# EAGLE design optoSensor (EAGLE 9.6.2)
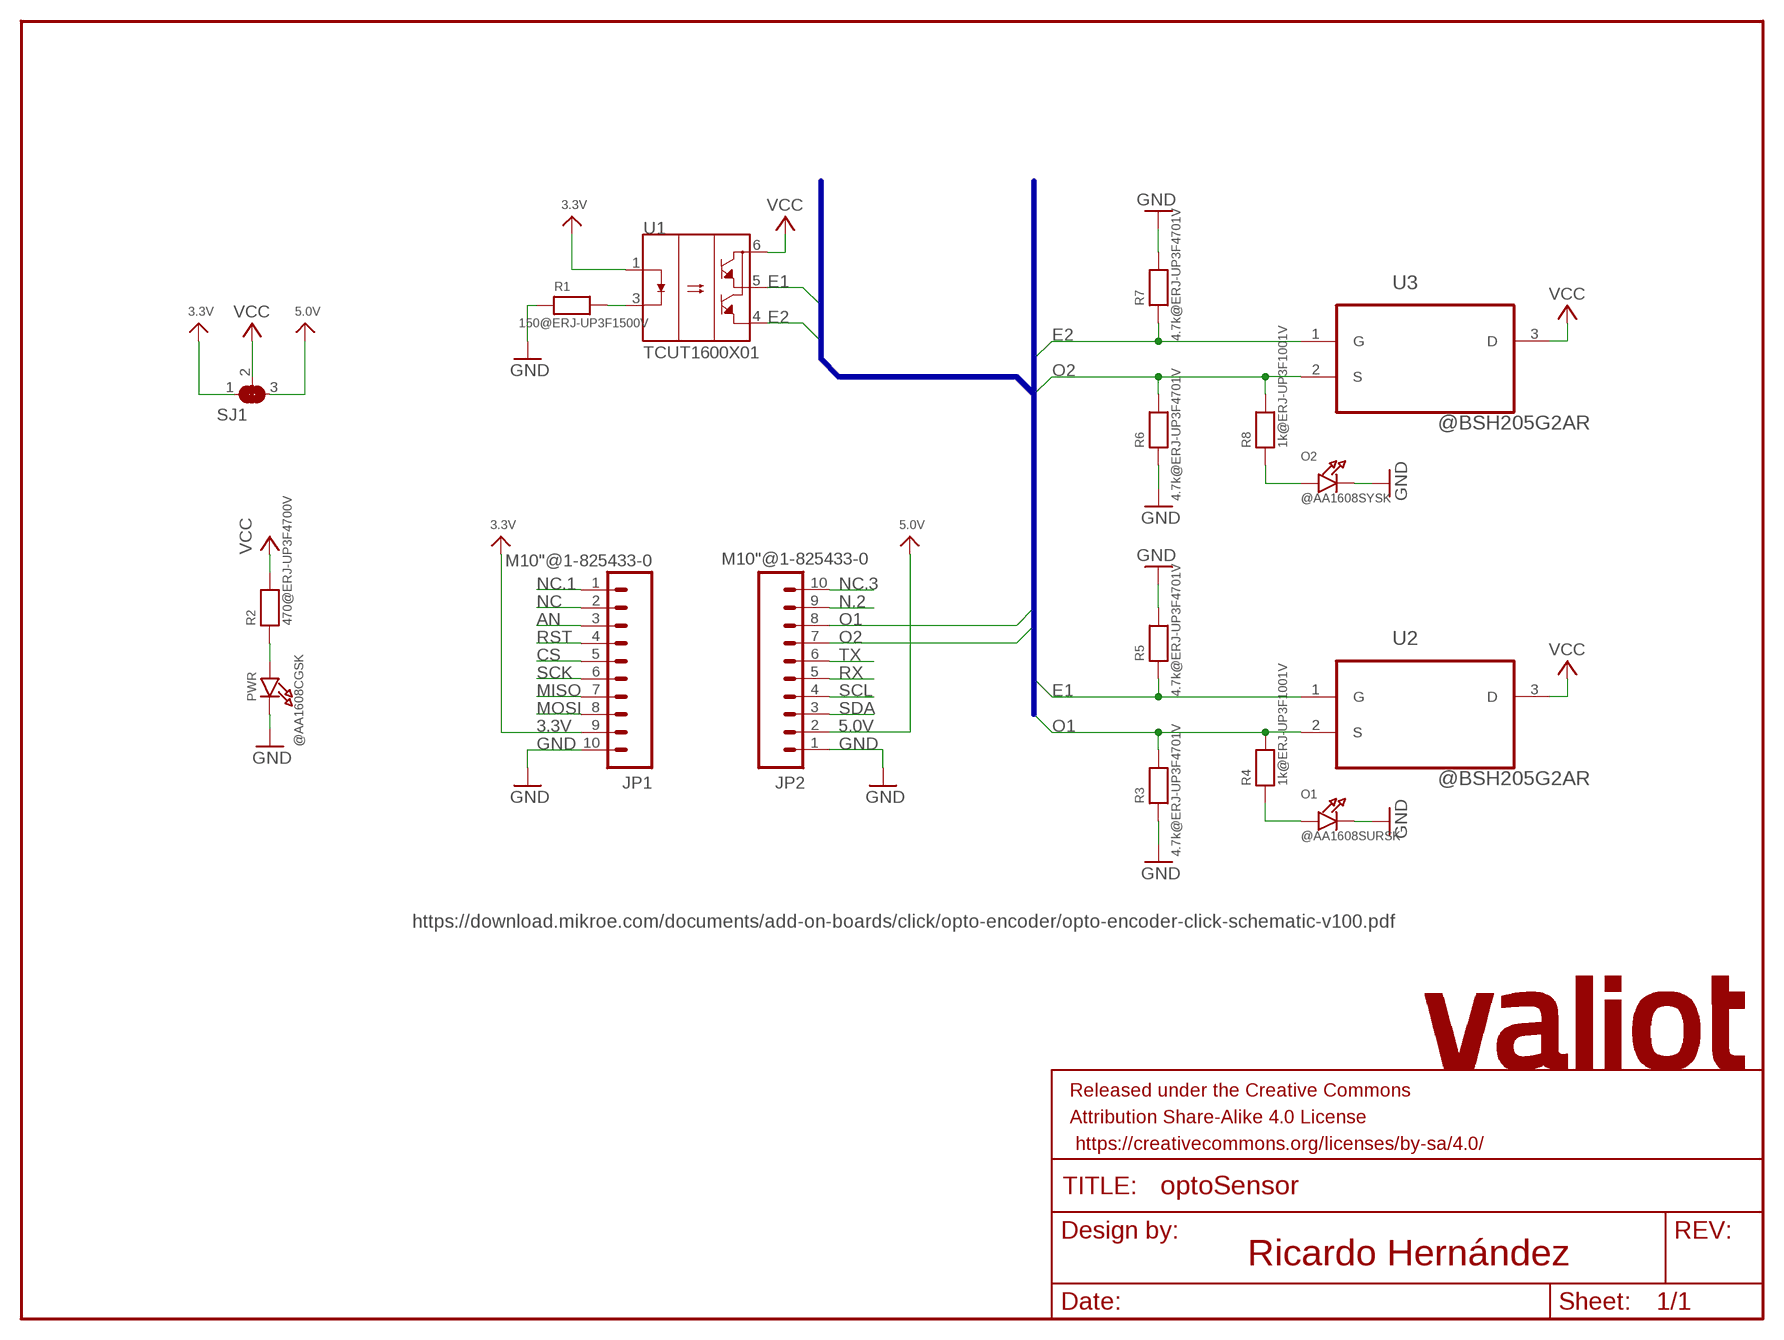
[diagram p0: schematic, sheet 1]

## Parts
FRAME1  FRAME-LETTER  [CREATIVE_COMMONS]
JP1  M10"@1-825433-0  M10"  [1X10]
JP2  M10"@1-825433-0  M10"  [1X10]
O1  @AA1608SURSK  LED0603_NOOUTLINE  [CHIPLED_0603_NOOUTLINE]
O2  @AA1608SYSK  LED0603_NOOUTLINE  [CHIPLED_0603_NOOUTLINE]
PWR  @AA1608CGSK  LED0603_NOOUTLINE  [CHIPLED_0603_NOOUTLINE]
R1  150@ERJ-UP3F1500V  RESISTOR0603  [0603]
R2  470@ERJ-UP3F4700V  RESISTOR0603  [0603]
R3  4.7k@ERJ-UP3F4701V  RESISTOR0603  [0603]
R4  1k@ERJ-UP3F1001V  RESISTOR0603  [0603]
R5  4.7k@ERJ-UP3F4701V  RESISTOR0603  [0603]
R6  4.7k@ERJ-UP3F4701V  RESISTOR0603  [0603]
R7  4.7k@ERJ-UP3F4701V  RESISTOR0603  [0603]
R8  1k@ERJ-UP3F1001V  RESISTOR0603  [0603]
SJ1  SOLDERJUMPER_2WAY0603  [SOLDERJUMPER_2WAY_OPEN_0603]
U1  TCUT1600X01  [XDCR_TCUT1600X01]
U2  @BSH205G2AR  DMP2305U-7  [SOT103P240X110-3N]
U3  @BSH205G2AR  DMP2305U-7  [SOT103P240X110-3N]

## Nets
3.3V: JP1.9 SJ1.1 U1.1(A)
5.0V: JP2.2 SJ1.3
AN: JP1.3
CS: JP1.5
E1: R5.1 U1.5(E1) U2.1(G)
E2: R7.1 U1.4(E2) U3.1(G)
GND: JP1.10 JP2.1 O1.C O2.C PWR.C R1.1 R3.1 R5.2 R6.1 R7.2
MISO: JP1.7
MOSI: JP1.8
N$1: R1.2 U1.3(CATH)
N$2: PWR.A R2.1
N$3: O1.A R4.1
N$4: O2.A R8.1
N.2: JP2.9
NC: JP1.2
NC.1: JP1.1
NC.3: JP2.10
O1: JP2.8 R3.2 R4.2 U2.2(S)
O2: JP2.7 R6.2 R8.2 U3.2(S)
RST: JP1.4
RX: JP2.5
SCK: JP1.6
SCL: JP2.4
SDA: JP2.3
TX: JP2.6
VCC: R2.2 SJ1.2 U1.6(COLL) U2.3(D) U3.3(D)

## Buses
OPTOBUS:E1,E2,O1,O2

## Notes on the sheet
- https://download.mikroe.com/documents/add-on-boards/click/opto-encoder/opto-encoder-click-schematic-v100.pdf
- Ricardo Hernández

## Library data of the parts
FRAME1 = SparkFun-Aesthetics:FRAME-LETTER: Schematic Frame - Letter Standard 8.5x11 US Letter frame
JP1 JP2 = SparkFun:M10: Header 10 Standard 10-pin 0.1" header. Use with straight break away headers (SKU : PRT-00116), right angle break away headers (PRT-00553), swiss pins (PRT-00743), machine pins (PRT-00117), and female headers (PRT-00115).
O1 O2 PWR = microbuilder:LED: LED 0603 - 0603 Surface Mount Package 2mA: Green LED - Low Power (3.9mcd, 2ma, 1.7Vf) - Digikey: 475-2709-2-ND Orange LED - Low Power (9.8mcd, 2ma, 1.8Vf) - Digikey: 475-1194-2-ND Red LED - Low Power (5mcd, 2ma, 1.8Vf) - Digikey: 475-1195-2-ND Yellow LED - Low Power (7mcd, 2ma, 1.8Vf) - Digikey: 475-1196-2-ND 5mA: Blue LED - Low Power (17mcd, 5ma, 2.9Vf) - Digikey: LNJ937W8CRACT-ND 0805 - 0805 Surface Mount Package 2mA: Red LED (8.8mcd, 2mA, 1.8Vf, Clear) - Low Power [Digikey: 475-2510-1-ND] Green LED (5mcd, 2mA, 1.8Vf, Clear) - Low Power [Digikey: 475-2730-1-ND] Yellow LED (11.3mcd, 2mA, 1.8Vf, Clear) - Low Power [Digikey: 475-2555-1-ND] 20mA: Red LED (104mcd, 20mA, Diffused) - LS R976 [Digikey: 475-1278-6-ND] Red LED (12mcd, 20mA, 2.0Vf, Clear) - APT2012EC [Digikey: 754-1128-1-ND] Green LED (15mcd, 20mA, 2.2Vf, Clear) - APT2012GC [Digikey: 754-1131-1-ND] Orange LED (160mcd, 20mA, 2.1Vf, Clear) - APT2012SECK [Digikey: 754-1130-1-ND] 1206 - 1206 Surface Mount Package Green LED (26mcd, 20mA, Diffused) - LG N971 [Digikey: 475-1407-6-ND] Red LED (15mcd, 20mA, Diffused) - LH N974 [Digikey: 475-1416-6-ND]
R1-R8 = microbuilder:RESISTOR: Resistors 0402 - 0402 Surface Mount Package 22 Ohm 1% 1/16W [Digikey: 311-22.0LRTR-ND] 33 Ohm 5% 1/16W 1.0K 5% 1/16W 1.5K 5% 1/16W 2.0K 1% 1/16W 10.0K 1% 1/16W [Digikey: 311-10.0KLRTR-ND] 10.0K 5% 1/16W [Digikey: RMCF0402JT10K0TR-ND] 12.1K 1% 1/16W [Digikey: 311-22.0LRTR-ND] 100.0K 5% 1/16W 0603 - 0603 Surface Mount Package 0 Ohm 1/10 Watt 1% Resistor 15 Ohm 1/10 Watt 1% Resistor 33 Ohm 1/10 Watt 1% Resistor 49.9 Ohm 1/10 Watt 1% Resistor 100 Ohm 1/10 Watt 1% Resistor 150 Ohm 1/10 Watt 1% Resistor 240 Ohm 1/10 Watt 1% Resistor 390 Ohm 1/10 Watt 1% Resistor 560 Ohm 1/10 Watt 1% Resistor 680 Ohm 1/10 Watt 1% Resistor 750 Ohm 1/10 Watt 1% Resistor 1.0K Ohm 1/10 Watt 1% Resistor 1.5K Ohm 1/10 Watt 1% Resistor 2.0K Ohm 1/10 Watt 1% Resistor 2.2K Ohm 1/10 Watt 1% Resistor 3.3K Ohm 1/10 Watt 1% Resistor 4.7K Ohm 1/10 Watt 1% Resistor 10.0K Ohm 1/10 Watt 1% Resistor 12.0K Ohm 1/10 Watt 1% Resistor 12.1K Ohm 1/10 Watt 1% Resistor 20.0K Ohm 1/10 Watt 1% Resistor 33.0K Ohm 1/10 Watt 1% Resistor 100.0K Ohm 1/10 Watt 1% Resistor 0805 - 0805 Surface Mount Package 0 Ohm 1/8 Watt 1% Resistor 33 Ohm 1/8 Watt 1% Resistor 100 Ohm 1/8 Watt 1% Resistor 150 Ohm 1/8 Watt 1% Resistor 200 Ohm 1/8 Watt 1% Resistor 240 Ohm 1/8 Watt 1% Resistor 330 Ohm 1/8 Watt 1% Resistor 390 Ohm 1/8 Watt 1% Resistor 470 Ohm 1/8 Watt 1% Resistor 1.0K Ohm 1/8 Watt 1% Resistor 1.5K Ohm 1/8 Watt 1% Resistor 2.0K Ohm 1/8 Watt 1% Resistor 4.7K Ohm 1/8 Watt 1% Resistor 5.1K Ohm 1/8 Watt 1% Resistor 5.6K Ohm 1/8 Watt 1% Resistor 10.0K Ohm 1/8 Watt 1% Resistor 22.0K Ohm 1/8 Watt 1% Resistor 33.0K Ohm 1/8 Watt 1% Resistor 100K Ohm 1/8 Watt 1% Resistor 1206 - 1206 Surface Mount Package 2012 - 2010 Surface Mount Package 0.11 Ohm 1/2 Watt 1% Resistor - Digikey: RHM.11UCT-ND
SJ1 = microbuilder:SOLDERJUMPER_2WAY: 2-Way Solder Jumper
U1 = TCUT1600X01:TCUT1600X01: SENSOR OPTO TRANS 3MM 6-SMD Check prices <https://pricing.snapeda.com/parts/TCUT1600X01/Vishay%20Semiconductor%20Opto%20Division/view-part?ref=eda>; AVAILABILITY: In Stock; DESCRIPTION: Optical Sensor Through-Beam 0.118 (3mm) Phototransistor Module, No Lead, Slot Type; MF: Vishay Semiconductor Opto Division; MP: TCUT1600X01; PACKAGE: Module No Lead Slot Type Vishay Semiconductor Opto Division; PRICE: None
U2 U3 = DMP2305U-7:DMP2305U-7: P-CHANNEL ENHANCEMENT MODE MOSFET Check prices <https://pricing.snapeda.com/parts/DMP2305U-7/Diodes%20Inc./view-part?ref=eda>; AVAILABILITY: In Stock; DESCRIPTION: P-Channel 20V 4.2A (Ta) 1.4W (Ta) Surface Mount SOT-23-3; MF: Diodes Inc.; MP: DMP2305U-7; PACKAGE: SOT-23 Multicomp; PRICE: None

## Board
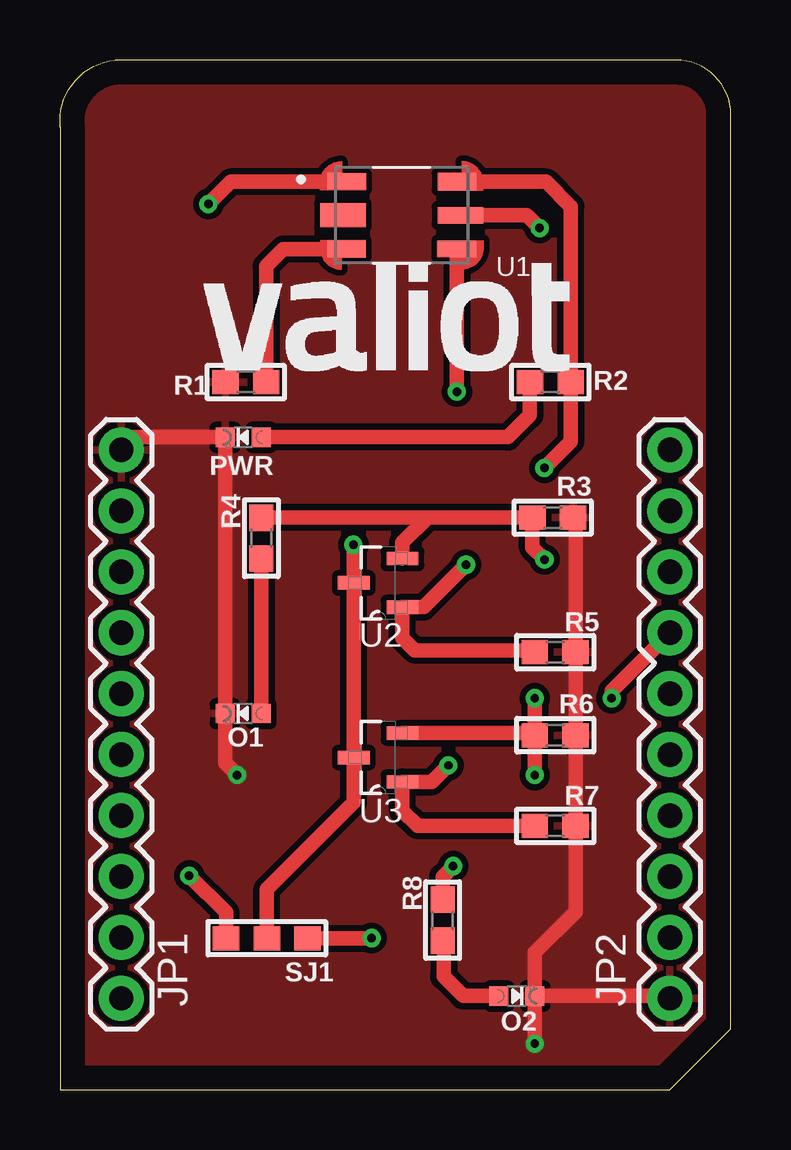
[diagram p1: board, top side]
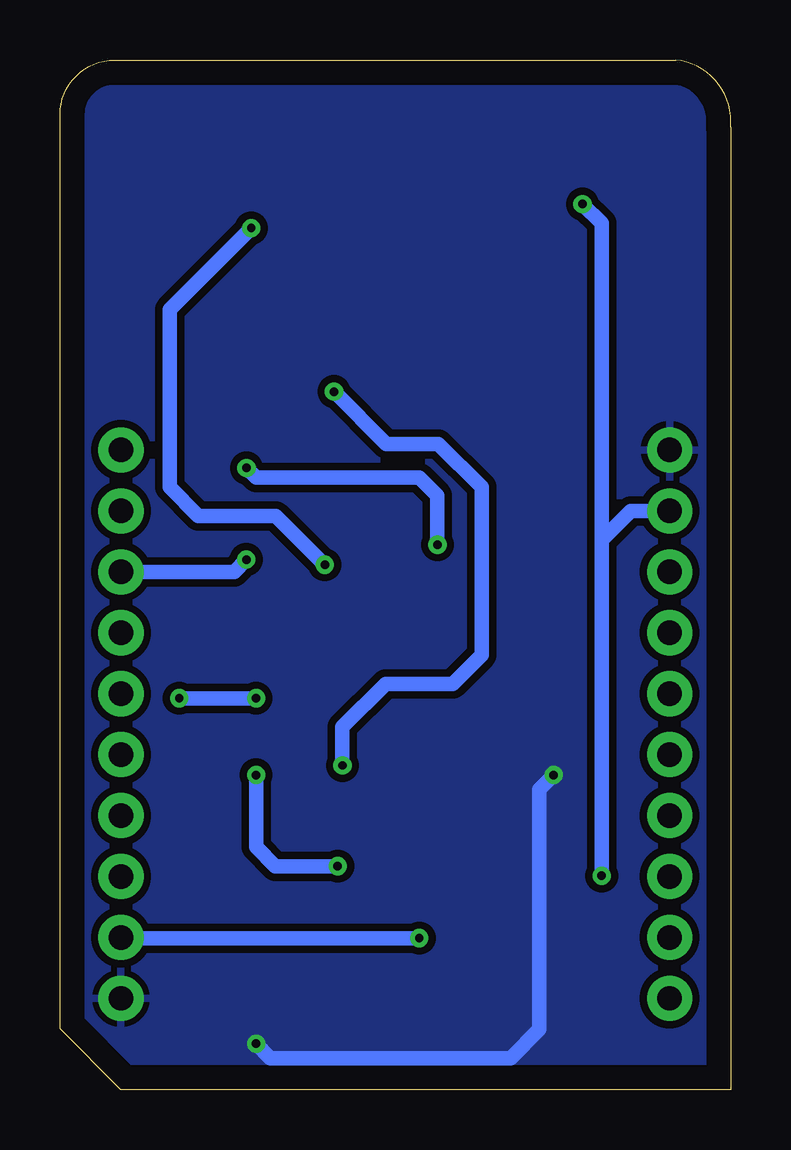
[diagram p2: board, bottom side, seen from below]

Size 27.95 x 42.93 mm. Coordinates in mm from the lower left corner, seen from the top.
Outline: 27.95,2.54 27.95,40.64 arc90 25.67,42.93 2.3,42.93 arc90 0.01,40.12 0.01,0 25.41,0 27.95,2.54
Copper layers (1*16): Top 0.035mm / dielectric 1.5mm / Bottom 0.035mm
Design rules "default": minimum track width 6mil, minimum drill 0.35mm, track to track 6mil, track to pad 6mil, pad to pad 6mil, via to via 6mil, smd to smd 6mil, copper to edge 40mil, drill to drill 6mil, minimum pad ring 10mil, minimum via ring 8mil, stop-mask expansion 4mil, vias tented up to drill 0mil, thermal gap 10mil

### Footprints (pad centres in the part's own frame; a part is rotated, then mirrored left to right if it is on the bottom)
1X10 = drill 1.016 pad 1.88: 1 0,0; 2 2.54,0; 3 5.08,0; 4 7.62,0; 5 10.16,0; 6 12.7,0; 7 15.24,0; 8 17.78,0; 9 20.32,0; 10 22.86,0
CHIPLED_0603_NOOUTLINE = smd 0.8 x 0.8: A 0,-0.75; C 0,0.75
0603 = smd 1.1 x 1: 1 -0.85,0; 2 0.85,0
SOLDERJUMPER_2WAY_OPEN_0603 = smd 1.1 x 1: 1 -1.7,0; 2 0,0; 3 1.7,0
XDCR_TCUT1600X01 = smd 1.6 x 0.7: 1 -2.3,1.4; 3 -2.3,-1.4; 4 2.3,-1.4; 6 2.3,1.4 | smd 1.9 x 1: 2 -2.45,0 | smd 1.9 x 0.7: 5 2.45,0
SOT103P240X110-3N = smd 1.321 x 0.559: 1 -1.016,1.016; 2 -1.016,-1.016; 3 1.016,0

### Placement (x,y rotation side)
FRAME1  -6.34,-12.7 0 top  (outside the outline)
JP1  2.55,3.81 90 top
JP2  25.41,3.81 90 top
O1  7.63,15.68 90 top
O2  19.04,3.91 270 top
PWR  7.63,27.2 90 top
R1  7.74,29.5 0 top
R2  20.43,29.5 0 top
R3  20.53,23.85 180 top
R4  8.39,22.99 90 top
R5  20.63,18.24 0 top
R6  20.63,14.78 180 top
R7  20.63,11 0 top
R8  15.94,7.07 90 top
SJ1  8.62,6.31 0 top
U1  14.24,36.45 0 top
U2  13.25,21.13 180 top
U3  13.25,13.85 180 top
U$7  [VALIOT_15X5MM]  5.99,29.96 0 top

### Tracks (layer width: path | path; a pad name or v marks a point on that pad's centre or on a via)
3.3V  (via drill 0.35)
  Top 0.61: U1.1 7.11,37.85 v6.18,36.92 | SJ1.1 6.92,7.38 v5.38,8.92
  Bottom 0.61: v5.38,8.92 5.38,22.92 | JP1.9 4.17,24.13 5.38,22.92 | 5.38,22.92 5.38,36.12 v6.18,36.92
5.0V  (via drill 0.35)
  Top 0.61: SJ1.3 v12.98,6.31 v12.98,6.32
  Bottom 0.61: v12.98,6.32 25.38,6.32 JP2.2
E1  (via drill 0.35)
  Top 0.61: R5.1 19.7,18.32 14.78,18.32 14.27,18.83 U2.1 15.15,20.11 v16.92,21.88 | U1.5 19.45,36.45 v19.98,35.92
  Bottom 0.61: v16.92,21.88 18.95,23.92 22.18,23.92 23.38,25.12 23.38,32.52 v19.98,35.92
E2  (via drill 0.35)
  Top 0.61: v16.18,13.52 15.5,12.83 U3.1 14.27,11.63 14.9,11 R7.1 | U1.4 v16.54,29.1
  Bottom 0.61: v16.18,13.52 16.18,15.12 14.38,16.92 11.58,16.92 10.38,18.12 10.38,25.12 12.18,26.92 14.36,26.92 v16.54,29.1
GND  (via drill 0.35)
  Top 0.61: JP2.1 25.32,3.91 O2.C | O2.C 19.78,5.72 21.48,7.42 R7.2 R6.1 R5.2 21.48,23.75 R3.1 | O1.C 6.88,13.62 v7.38,13.12 | v19.78,1.92 O2.C | O1.C | O1.C PWR.C 3.08,27.2 JP1.10
  Bottom 0.61: v7.38,13.12 7.98,12.52 7.98,2.52 9.18,1.32 19.18,1.32 v19.78,1.92
  pour Top (isolate 0.254): -2.53,45.72 30.49,45.72 30.49,-1.27 -2.53,-1.27
  pour Bottom (isolate 0.305): -2.53,45.72 30.49,45.72 30.49,-1.27 -2.53,-1.27
N$1
  Top 0.61: R1.2 8.59,34.33 9.31,35.05 U1.3
N$2
  Top 0.61: R2.1 19.58,28.12 18.66,27.2 PWR.A
N$3
  Top 0.61: R4.1 8.39,15.69 O1.A
N$4
  Top 0.61: R8.1 15.98,6.18 15.98,4.72 16.8,3.91 O2.A
O1  (via drill 0.35)
  Top 0.61: 15.31,23.85 R3.2 19.68,22.61 v20.19,22.1 | U2.2 14.27,22.81 15.31,23.85 | 15.31,23.85 R4.2
  Bottom 0.61: JP2.8 20.7,21.59 v20.19,22.1
O2  (via drill 0.35)
  Top 0.61: R8.2 15.94,8.88 v16.38,9.32 | JP2.7 22.98,16.62 v22.98,16.32 | v19.78,16.32 R6.2 | v19.78,13.12 R6.2 | U3.2 19.7,14.87 R6.2
  Bottom 0.61: v22.98,16.32 v19.78,16.32 | v16.38,9.32 18.98,9.32 19.78,10.12 v19.78,13.12
VCC  (via drill 0.35)
  Top 0.61: SJ1.2 8.62,8.35 12.24,11.97 U3.3 U2.3 12.24,22.71 v12.22,22.72 | U1.6 20.25,37.85 21.28,36.82 R2.2 21.28,27.02 v20.18,25.92
  Bottom 0.61: v12.22,22.72 12.22,24.76 12.98,25.52 19.78,25.52 v20.18,25.92

### Text on the board
tDocu: Ricardo Hernández